# EasyEDA schematic SCHEMATICS_TAKEMINAKATA.json
TITLE: Sheet_2; REV: 1.0; Date: 2023-05-16; Sheet: 1/1; Drawn By: kdab1175; Company: Your Company
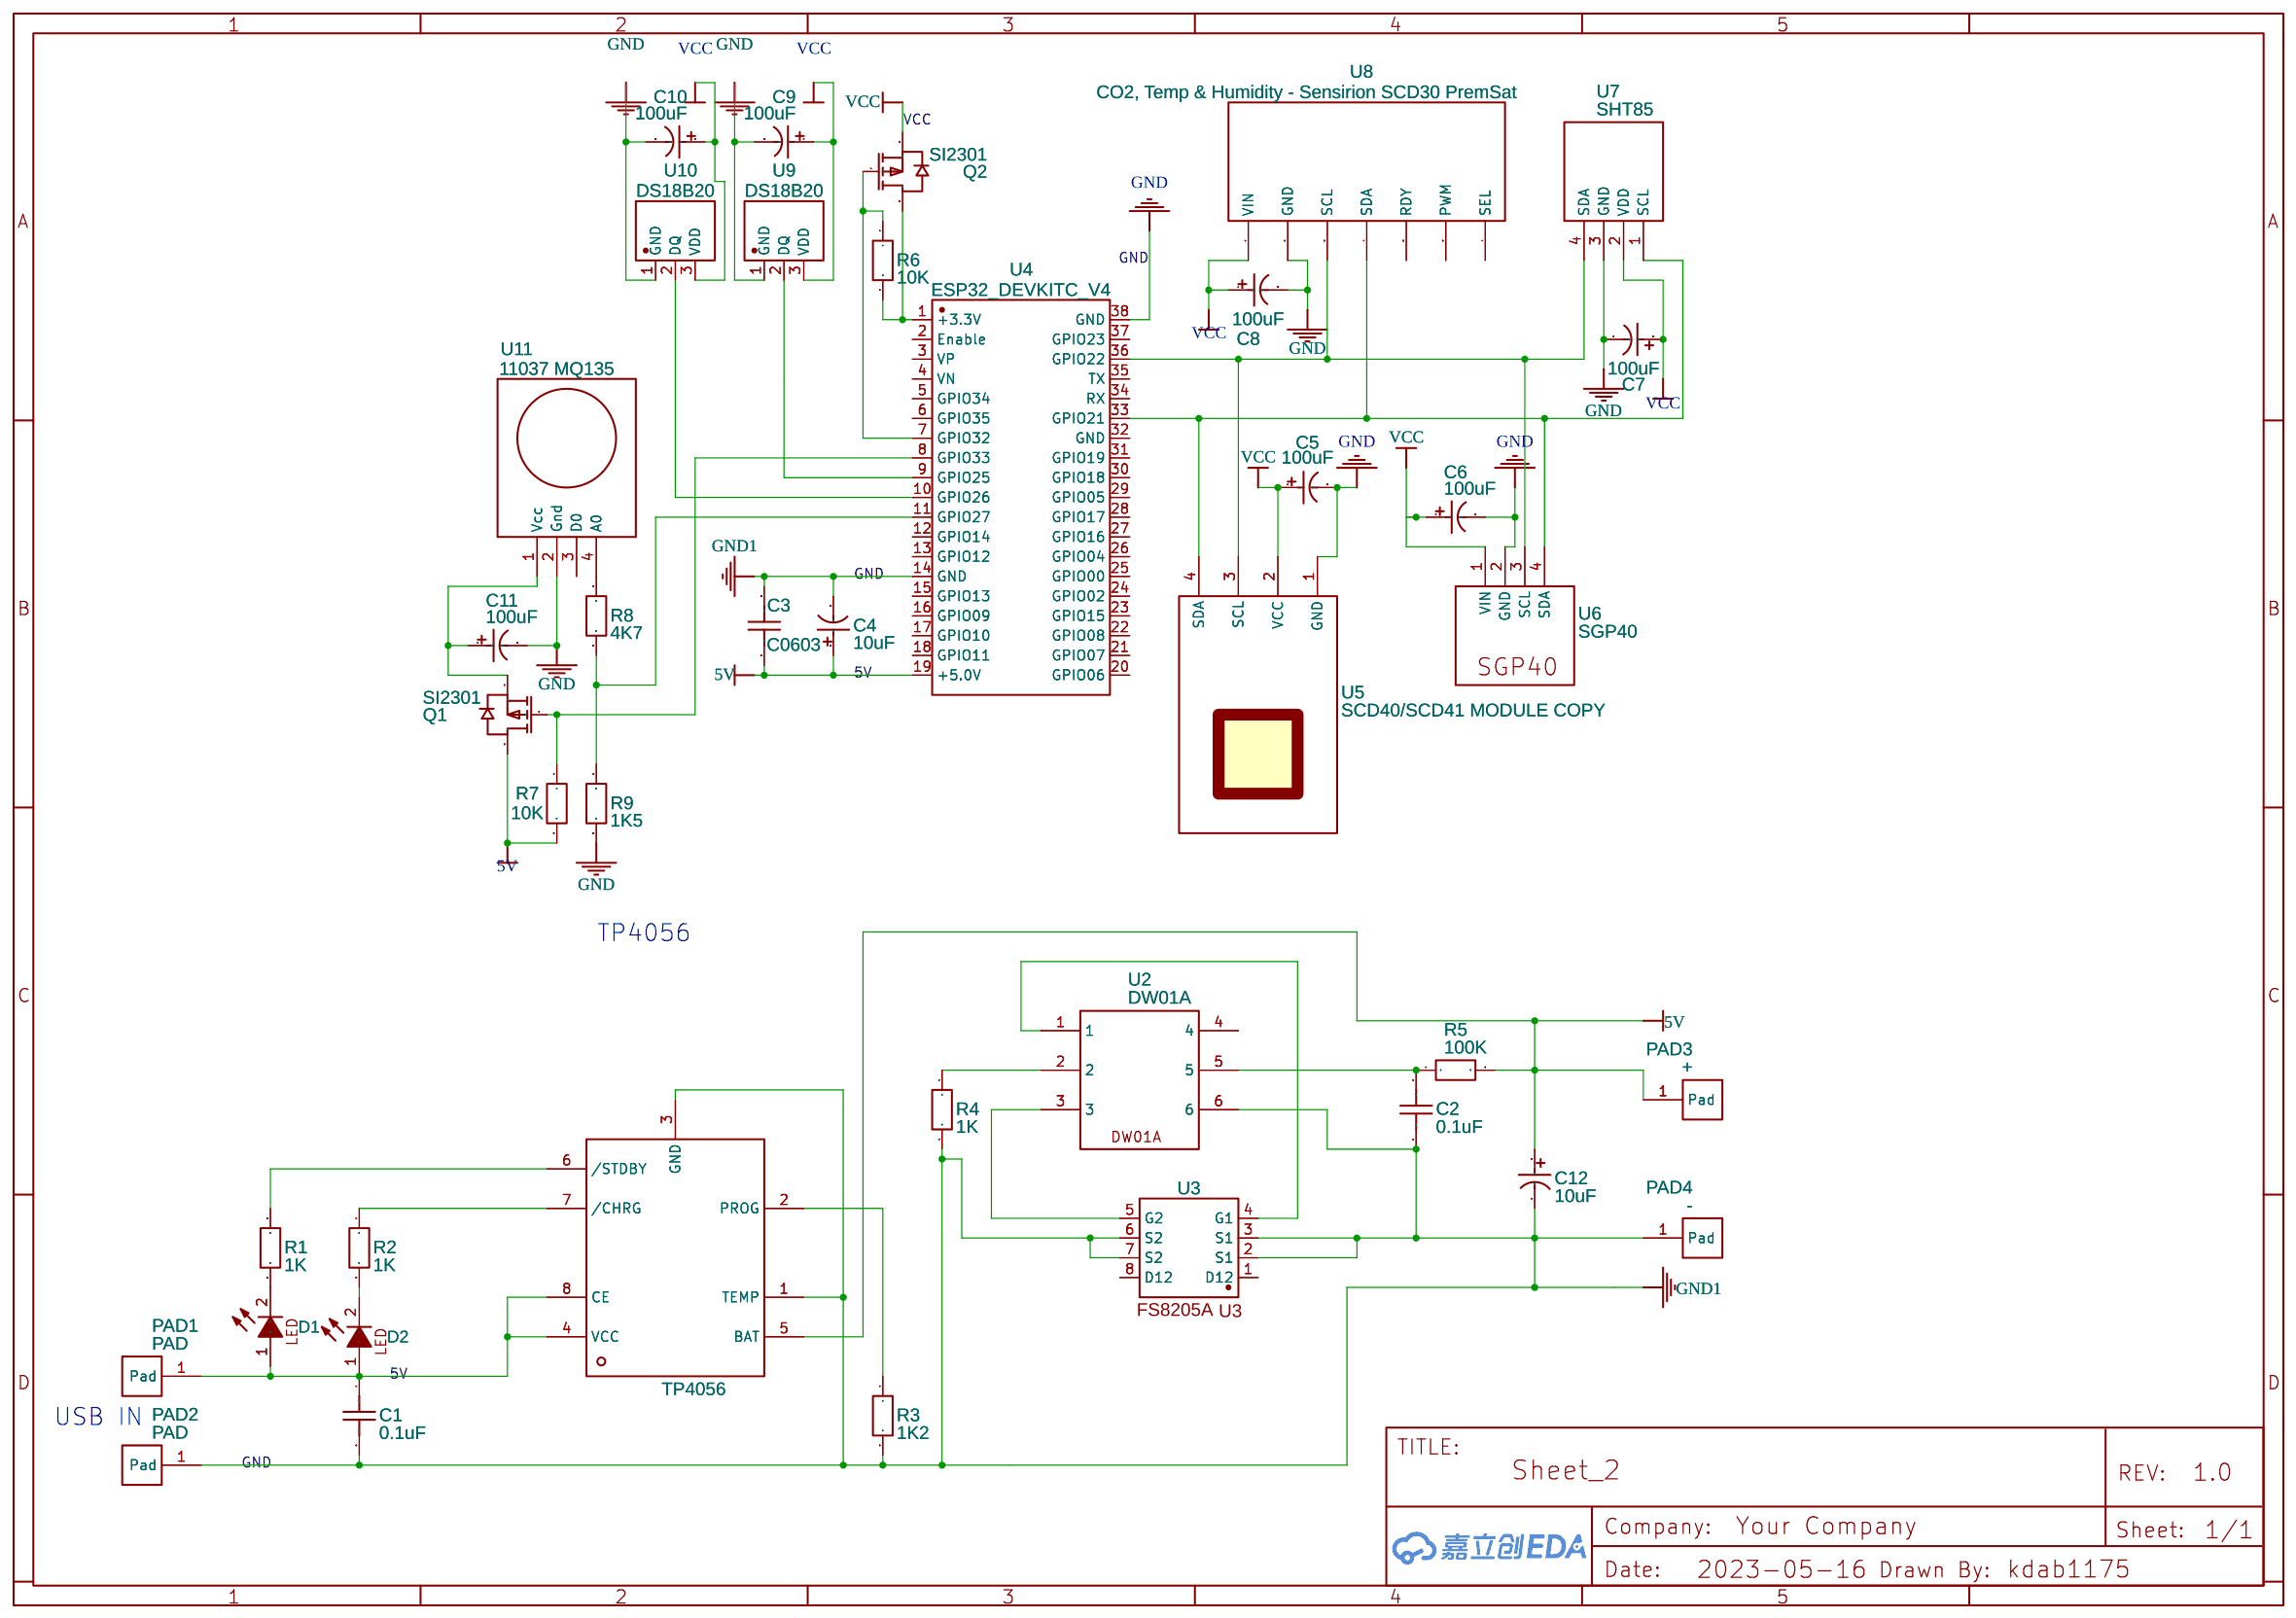
[diagram p0: schematic sheet]

## Parts
C1  0.1uF  [C0603]
C2  0.1uF  [C0603]
C3  C0603  [C0603]
C4  10uF  [CAP-TH_BD4.0-P1.50-D0.8-FD]
C5  100uF  [CAP-TH_BD6.3-P2.50-D0.5-FD]
C6  100uF  [CAP-TH_BD6.3-P2.50-D0.5-FD]
C7  100uF  [CAP-TH_BD6.3-P2.50-D0.5-FD]
C8  100uF  [CAP-TH_BD6.3-P2.50-D0.5-FD]
C9  100uF  [CAP-TH_BD6.3-P2.50-D0.5-FD]
C10  100uF  [CAP-TH_BD6.3-P2.50-D0.5-FD]
C11  100uF  [CAP-TH_BD6.3-P2.50-D0.5-FD]
C12  10uF  [CAP-TH_BD4.0-P1.50-D0.8-FD]
D1  LED  [LED-TH_LED-DP2-2LED-AMCC]
D2  LED COPY  [LED-TH_LED-DP2-2LED-AMCC]
PAD1  PAD  [PADPAD]
PAD2  PAD  [PADPAD]
PAD3  +  [PADPAD]
PAD4  -  [PADPAD]
Q1  SI2301  [SOT-23-3_L2.9-W1.3-P1.90-LS2.4-BR]
Q2  SI2301  [SOT-23-3_L2.9-W1.3-P1.90-LS2.4-BR]
R1  1K  [R0603]
R2  1K  [R0603]
R3  1K2  [R0603]
R4  1K  [R0603]
R5  100K  [R0603]
R6  10K  [R0603]
R7  10K  [R0603]
R8  4K7  [R0603]
R9  1K5  [R0603]
U1  TP4056  [SOP-8-PP]
U2  DW01A  [DW01A]
U3  FS8205A MODIF  [FS8205A MODIF]
U4  ESP32_DEVKITC_V4  [ESP32-DEVKITC CORE BOARD ESP32]
U5  SCD40/SCD41 MODULE COPY  [SCD40/SCD41 MODULE]
U6  SGP40  [SGP40]
U7  SHT85  [SHT85]
U8  CO2, Temp & Humidity - Sensirion SCD30 PremSat  [SCD30]
U9  DS18B20  [TO-92-3_L4.9-W3.7-P1.27-L]
U10  DS18B20  [TO-92-3_L4.9-W3.7-P1.27-L]
U11  11037 MQ135  [MQ135]

## Library data of the parts
C1 C2 = C_0603_US: Contributor: LCEDA_Lib
C3 = C 0603: Supplier: LCSC; Supplier Part: C15415; Manufacturer: Samsung Electro-Mechanics; Manufacturer Part: 10uF; Contributor: LCSC
C4 C12 = 10uF 16V 3*5: Supplier: LCSC; Manufacturer: CX(承兴); Manufacturer Part: KF106M016B05RR0VH2FP0; Supplier Part: C43798; JLCPCB Part Class: Extended Part
C5-C11 = 100uF 35V 6.3*11_C45076: Supplier Part: C45076; Supplier: LCSC; Manufacturer: ValuePro; Manufacturer Part: 100uF 35V 6.3*11; JLCPCB Part Class: Extended Part
D1 D2 = LED: Supplier: Digi-Key; Manufacturer: VccLite; Manufacturer Part: 5600; Supplier Part: L20325-ND; link: https://vcclite.com/product/5602f5-5v/; Contributor: tomevukic
PAD1-PAD4 = PAD COPY COPY: Contributor: michael hay
Q1 Q2 = SI2301DS_TH: Supplier: LCSC; Supplier Part: C2841444; Manufacturer: TECH PUBLIC(台舟); Manufacturer Part: SI2301DS; Contributor: thanhhoa300600; JLCPCB Part Class: Extended Part
R1-R9 = R_0603_EU: Contributor: LCEDA_Lib
U1 = TP4056: Supplier: SunROM; Manufacturer: NanJing Top Power ASIC Corp.; Manufacturer Part: TP4056-42-SOP8-PP; Supplier Part: 3656; link: https://www.sunrom.com/get/109600; Contributor: sachingpta
U2 = DW01A: Contributor: anleo
U3 = FS8205A MODIF: Contributor: maxi paternolli
U4 = ESP32_DEVKITC_V4: Supplier Part: A5130; link: https://www.allnewstep.com/product/5253/%E0%B8%9A%E0%B8%AD%E0%B8%A3%E0%B9%8C%E0%B8%94-esp32-devkitc-core-board-esp32-v4-development-board-esp32-wroom-32u; Contributor: Artur Janusz
U5 = SCD40/SCD41 MODULE COPY: Contributor: xyzroe
U6 = SGP40: Supplier: AliExpress; Contributor: mengrie
U7 = SHT85: Manufacturer: Sensirion; Supplier: Mouser; Supplier Part: 403-SHT85; link: https://www.mouser.com/ProductDetail/Sensirion/SHT85?qs=byeeYqUIh0OExKWW1Eu%252BLQ%3D%3D; Contributor: mdcraver
U8 = CO2, Temp & Humidity - Sensirion SCD30 PremSat: Manufacturer: Sensirion AG; Supplier: Digi-Key; Supplier Part: 1649-1098-ND; link: https://media.digikey.com/pdf/Data%20Sheets/Sensirion%20PDFs/CD_DS_SCD30_Datasheet_D1.pdf; Contributor: K J Vasoya
U9 U10 = DS18B20_C5379069: Supplier: LCSC; Supplier Part: C5379069; Manufacturer: MSKSEMI(美森科); link: https://atta.szlcsc.com/upload/public/pdf/source/20230321/E2B7C84673F98AE08C6B0E4EDF67430D.pdf; Contributor: lcsc
U11 = 11037 MQ135: Contributor: Angel Rivera

## Nets
5V: C1.1 C3.1 C4.1 C12.1 D1.1(A) D2.1(A) PAD1.1(Pad) PAD3.1(Pad) Q1.3(D) R5.2 R7.2 U1.4(VCC) U1.5(BAT) U1.8(CE) U4.19(+5.0V)
GND: C1.2 C2.2 C3.2 C4.2 C5.2 C6.2 C7.2 C8.2 C9.2 C10.2 C11.2 C12.2 PAD2.1(Pad) PAD4.1(Pad) R3.2 R4.2 R9.2 U1.1(TEMP) U1.3(GND) U2.6 U3.2(S1) U3.3(S1) U3.6(S2) U3.7(S2) U4.14(GND) U4.38(GND) U5.1(GND) U6.2(GND) U7.3(GND) U8.2(GND) U9.1(GND) U10.1(GND) U11.2(Gnd)
VCC: C5.1 C6.1 C7.1 C8.1 C9.1 C10.1 Q2.2(S) U5.2(VCC) U6.1(VIN) U7.2(VDD) U8.1(VIN) U9.3(VDD) U10.3(VDD)
Net-(C2-1): C2.1 R5.1 U2.5
Net-(C11-1): C11.1 Q1.2(S) U11.1(Vcc)
Net-(D1-2): D1.2(K) R1.2
Net-(D2-2): D2.2(K) R2.2
Net-(Q1-1): Q1.1(G) R7.1 U4.8(GPIO33)
Net-(Q2-1): Q2.1(G) R6.1 U4.7(GPIO32)
Net-(Q2-3): Q2.3(D) R6.2 U4.1(+3.3V)
Net-(R1-1): R1.1 U1.6(/STDBY)
Net-(R2-1): R2.1 U1.7(/CHRG)
Net-(R3-1): R3.1 U1.2(PROG)
Net-(R4-1): R4.1 U2.2
Net-(R8-1): R8.1 U11.4(A0)
Net-(R8-2): R8.2 R9.1 U4.11(GPIO27)
Net-(U2-1): U2.1 U3.4(G1)
Net-(U2-3): U2.3 U3.5(G2)
Net-(U4-9): U4.9(GPIO25) U9.2(DQ)
Net-(U4-10): U4.10(GPIO26) U10.2(DQ)
Net-(U4-33): U4.33(GPIO21) U5.4(SDA) U6.4(SDA) U7.1(SCL) U8.4(SDA)
Net-(U4-36): U4.36(GPIO22) U5.3(SCL) U6.3(SCL) U7.4(SDA) U8.3(SCL)

Not connected (* = marked no-connect by the designer): U2 4; U3 1(D12) 8(D12); U4 2(Enable) 3(VP) 4(VN) 5(GPIO34) 6(GPIO35) 12(GPIO14) 13(GPIO12) 15(GPIO13) 16(GPIO09) 17(GPIO10) 18(GPIO11) 20(GPIO06) 21(GPIO07) 22(GPIO08) 23(GPIO15) 24(GPIO02) 25(GPIO00) 26(GPIO04) 27(GPIO16) 28(GPIO17) 29(GPIO05) 30(GPIO18) 31(GPIO19) 32(GND) 34(RX) 35(TX) 37(GPIO23); U8 5(RDY) 6(PWM) 7(SEL); U11 3(D0)

## Notes on the sheet
- TP4056
- USB IN
